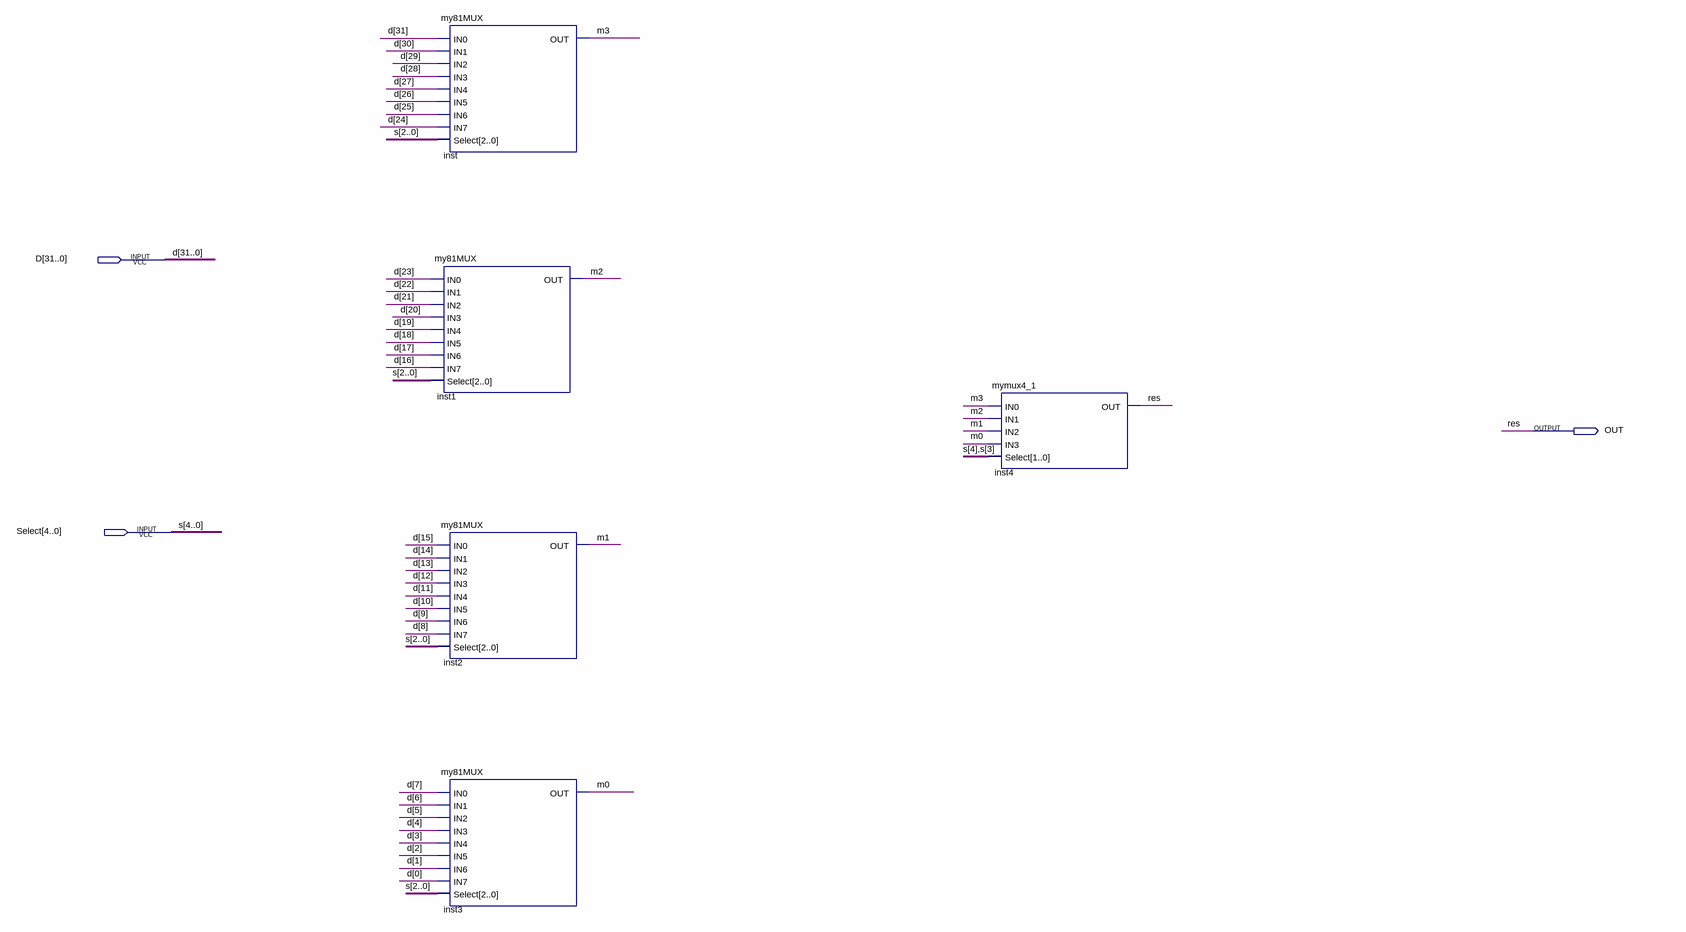
[diagram p0: schematic sheet]
// Quartus schematic mux_32bit.bdf as structural Verilog: 5 symbols, 3 pins
module mux_32bit (
  input  [31:0] D,
  input  [4:0] Select,
  output OUT
);

  wire m0, m1, m2, m3;

  my81MUX inst1 (
    .IN0(D[23]), .IN1(D[22]), .IN2(D[21]), .IN3(D[20]), .IN4(D[19]), .IN5(D[18]), .IN6(D[17]), .IN7(D[16]),
    .Select(Select[2:0]), .OUT(m2));
  my81MUX inst (
    .IN0(D[31]), .IN1(D[30]), .IN2(D[29]), .IN3(D[28]), .IN4(D[27]), .IN5(D[26]), .IN6(D[25]), .IN7(D[24]),
    .Select(Select[2:0]), .OUT(m3));
  my81MUX inst2 (
    .IN0(D[15]), .IN1(D[14]), .IN2(D[13]), .IN3(D[12]), .IN4(D[11]), .IN5(D[10]), .IN6(D[9]), .IN7(D[8]),
    .Select(Select[2:0]), .OUT(m1));
  my81MUX inst3 (
    .IN0(D[7]), .IN1(D[6]), .IN2(D[5]), .IN3(D[4]), .IN4(D[3]), .IN5(D[2]), .IN6(D[1]), .IN7(D[0]),
    .Select(Select[2:0]), .OUT(m0));
  mymux4_1 inst4 (.IN0(m3), .IN1(m2), .IN2(m1), .IN3(m0), .Select(Select[4:3]), .OUT(OUT));

  // Other names for the same wires on the sheet: res = OUT; s[4:0] = Select
endmodule
